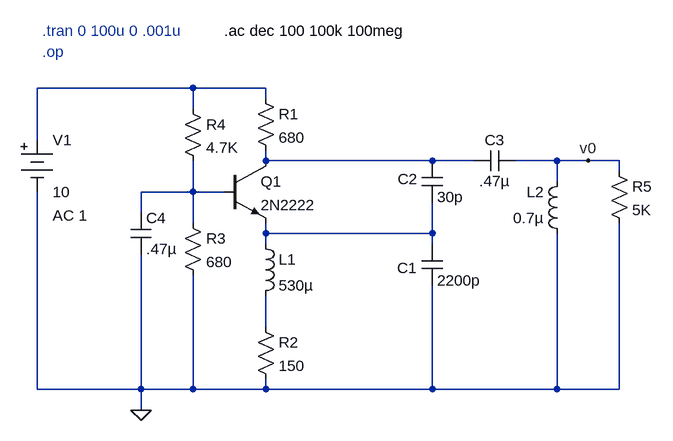
[diagram p0: schematic lc3.asc]
lc3.asc, the LTspice schematic file:
Version 4
SHEET 1 880 680
WIRE 112 0 -128 0
WIRE 224 0 112 0
WIRE 224 16 224 0
WIRE 112 32 112 0
WIRE -128 80 -128 0
WIRE 224 112 224 96
WIRE 480 112 224 112
WIRE 544 112 480 112
WIRE 672 112 608 112
WIRE 720 112 672 112
WIRE 768 112 720 112
WIRE 768 128 768 112
WIRE 672 144 672 112
WIRE 112 160 112 112
WIRE 112 160 32 160
WIRE 160 160 112 160
WIRE 32 192 32 160
WIRE 112 208 112 160
WIRE 224 224 224 208
WIRE 480 224 480 176
WIRE 480 224 224 224
WIRE 224 240 224 224
WIRE 480 240 480 224
WIRE 224 368 224 320
WIRE -128 464 -128 160
WIRE 32 464 32 256
WIRE 32 464 -128 464
WIRE 112 464 112 288
WIRE 112 464 32 464
WIRE 224 464 224 448
WIRE 224 464 112 464
WIRE 480 464 480 304
WIRE 480 464 224 464
WIRE 672 464 672 224
WIRE 672 464 480 464
WIRE 768 464 768 208
WIRE 768 464 672 464
WIRE 32 496 32 464
FLAG 32 496 0
FLAG 720 112 v0
SYMBOL npn 160 112 R0
SYMATTR InstName Q1
SYMATTR Value 2N2222
SYMBOL res 208 0 R0
SYMATTR InstName R1
SYMATTR Value 680
SYMBOL res 208 352 R0
SYMATTR InstName R2
SYMATTR Value 150
SYMBOL res 96 192 R0
SYMATTR InstName R3
SYMATTR Value 680
SYMBOL res 96 16 R0
SYMATTR InstName R4
SYMATTR Value 4.7K
SYMBOL Misc\\battery -128 64 R0
WINDOW 123 24 132 Left 2
WINDOW 39 0 0 Left 2
SYMATTR Value2 AC 1
SYMATTR InstName V1
SYMATTR Value 10
SYMBOL ind 208 224 R0
SYMATTR InstName L1
SYMATTR Value 530µ
SYMBOL ind 688 240 R180
WINDOW 0 36 80 Left 2
WINDOW 3 36 40 Left 2
SYMATTR InstName L2
SYMATTR Value 0.7µ
SYMBOL cap 464 112 R0
WINDOW 0 -37 28 Left 2
SYMATTR InstName C2
SYMATTR Value 30p
SYMBOL cap 464 240 R0
WINDOW 0 -38 37 Left 2
SYMATTR InstName C1
SYMATTR Value 2200p
SYMBOL cap 608 96 R90
WINDOW 0 0 32 VBottom 2
WINDOW 3 32 32 VTop 2
SYMATTR InstName C3
SYMATTR Value .47µ
SYMBOL cap 16 192 R0
SYMATTR InstName C4
SYMATTR Value .47µ
SYMBOL res 752 112 R0
SYMATTR InstName R5
SYMATTR Value 5K
TEXT -120 -88 Left 2 ;.tran 0 100u 0 .001u
TEXT -120 -56 Left 2 ;.op
TEXT 160 -88 Left 2 !.ac dec 100 100k 100meg

The netlist it stands for:
* lc3.asc
Q1 N002 N003 N004 0 2N2222
R1 N001 N002 680
R2 N005 0 150
R3 N003 0 680
R4 N001 N003 4.7K
V1 N001 0 10 AC 1
L1 N004 N005 530µ
L2 0 v0 0.7µ
C2 N002 N004 30p
C1 N004 0 2200p
C3 v0 N002 .47µ
C4 N003 0 .47µ
R5 v0 0 5K
.model NPN NPN
.model PNP PNP
.lib standard.bjt
* .tran 0 100u 0 .001u
* .op
.ac dec 100 100k 100meg
.backanno
.end